# EasyEDA schematic Maharani_Transmitter.json
TITLE: Sheet_1; REV: 1.0; Date: 2025-01-16; Sheet: 1/1; Drawn By: ulirberdulham; Company: Your Company
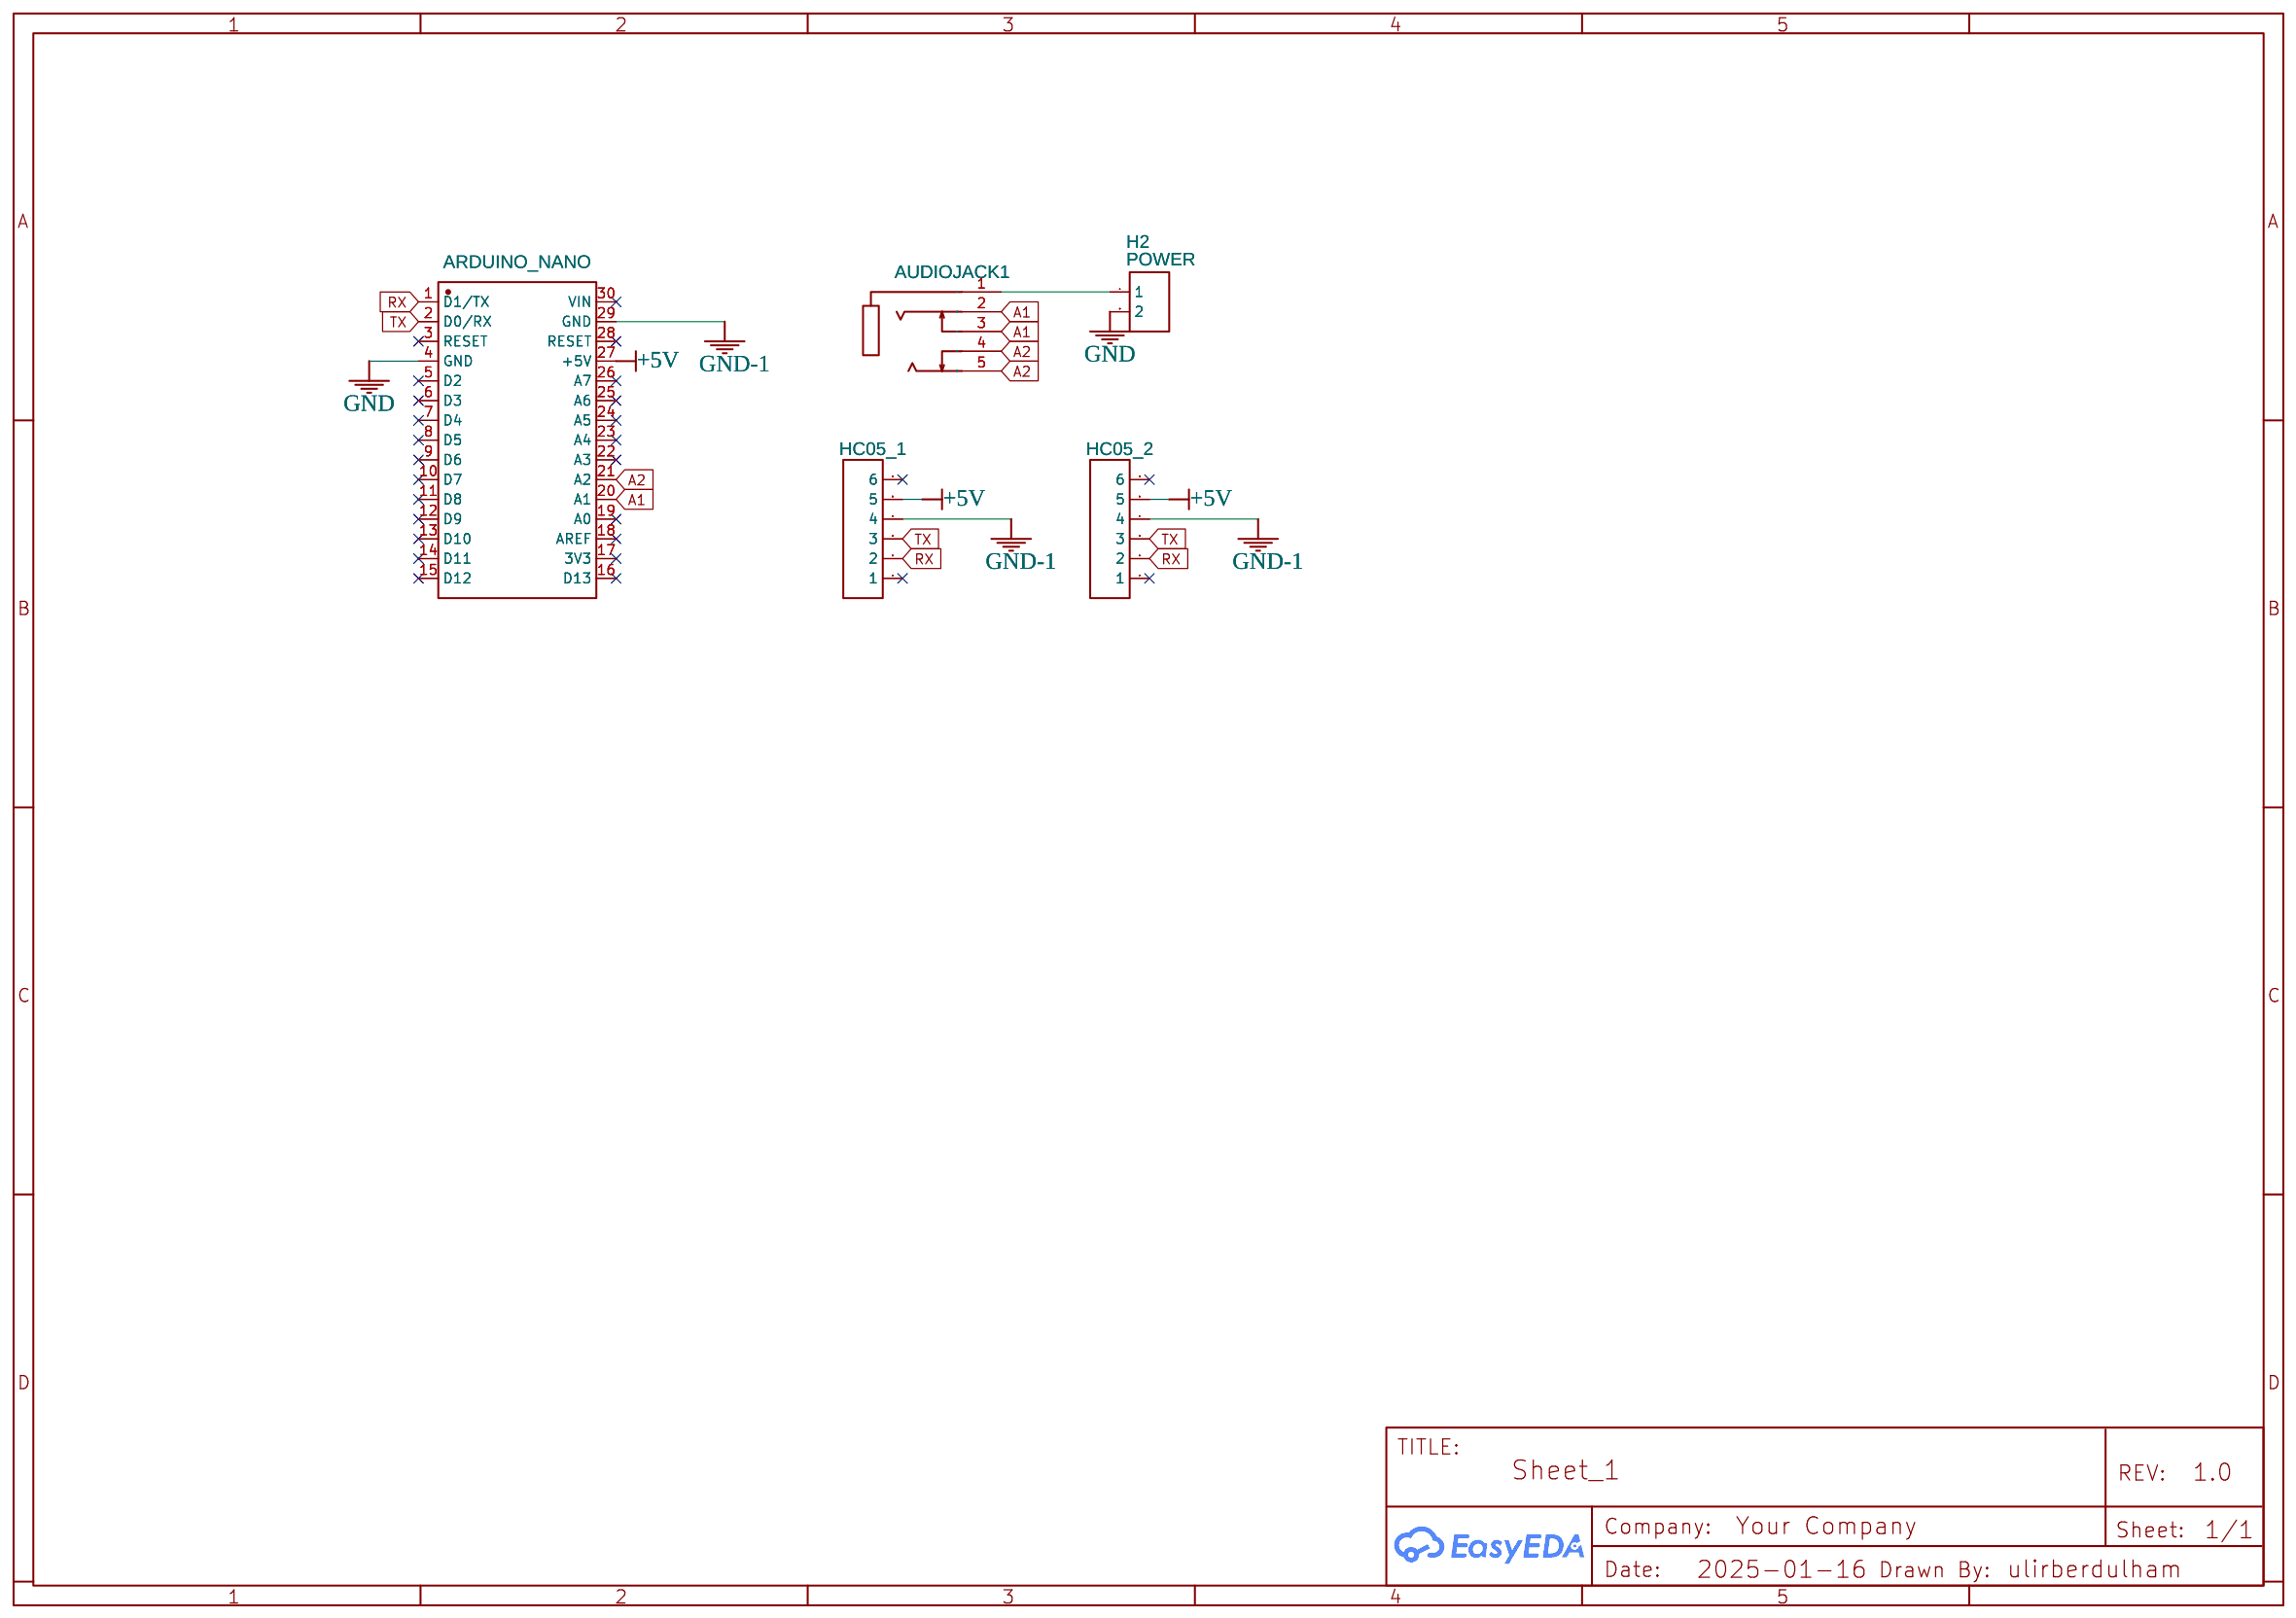
[diagram p0: schematic sheet]

## Parts
AUDIOJACK1  PJ-324  [AUDIO-TH_PJ-324-M]
H2  POWER  [HDR-F-2.54_1X2]
HC05_1  HDR-F-2.54_1x6  [HDR-F-2.54_1X6]
HC05_2  HDR-F-2.54_1x6  [HDR-F-2.54_1X6]
U4  ARDUINO_NANO  [COMM-TH_ARDUINO_NANO]

## Library data of the parts
AUDIOJACK1 = PJ-324: Supplier: LCSC; Supplier Part: C22355738; Manufacturer: SOFNG(硕方); JLCPCB Part Class: Extended Part; Contributor: lcsc
H2 = HDR-F-2.54_1x2: Supplier Part: C49661; Supplier: LCSC; Contributor: LCEDA_Lib
HC05_1 HC05_2 = HDR-F-2.54_1x6: Supplier Part: C40877; Supplier: LCSC; Contributor: LCEDA_Lib
U4 = ARDUINO_NANO: Contributor: lcsc; Supplier: LCSC; Supplier Part: C9900017879; Manufacturer: null; JLCPCB Part Class: Extended Part

## Nets
+5V: HC05_1.5 HC05_2.5 U4.27(+5V)
GND: H2.2 U4.4(GND)
GND-1: HC05_1.4 HC05_2.4 U4.29(GND)
A1: AUDIOJACK1.2 AUDIOJACK1.3 U4.20(A1)
A2: AUDIOJACK1.4 AUDIOJACK1.5 U4.21(A2)
RX: HC05_1.2 HC05_2.2 U4.1(D1/TX)
TX: HC05_1.3 HC05_2.3 U4.2(D0/RX)
Net-(AUDIOJACK1-1): AUDIOJACK1.1 H2.1

Not connected (* = marked no-connect by the designer): HC05_1 1* 6*; HC05_2 1* 6*; U4 3(RESET)* 5(D2)* 6(D3)* 7(D4)* 8(D5)* 9(D6)* 10(D7)* 11(D8)* 12(D9)* 13(D10)* 14(D11)* 15(D12)* 16(D13)* 17(3V3)* 18(AREF)* 19(A0)* 22(A3)* 23(A4)* 24(A5)* 25(A6)* 26(A7)* 28(RESET)* 30(VIN)*
